# EAGLE design v0.0.1 (EAGLE 9.3.0)
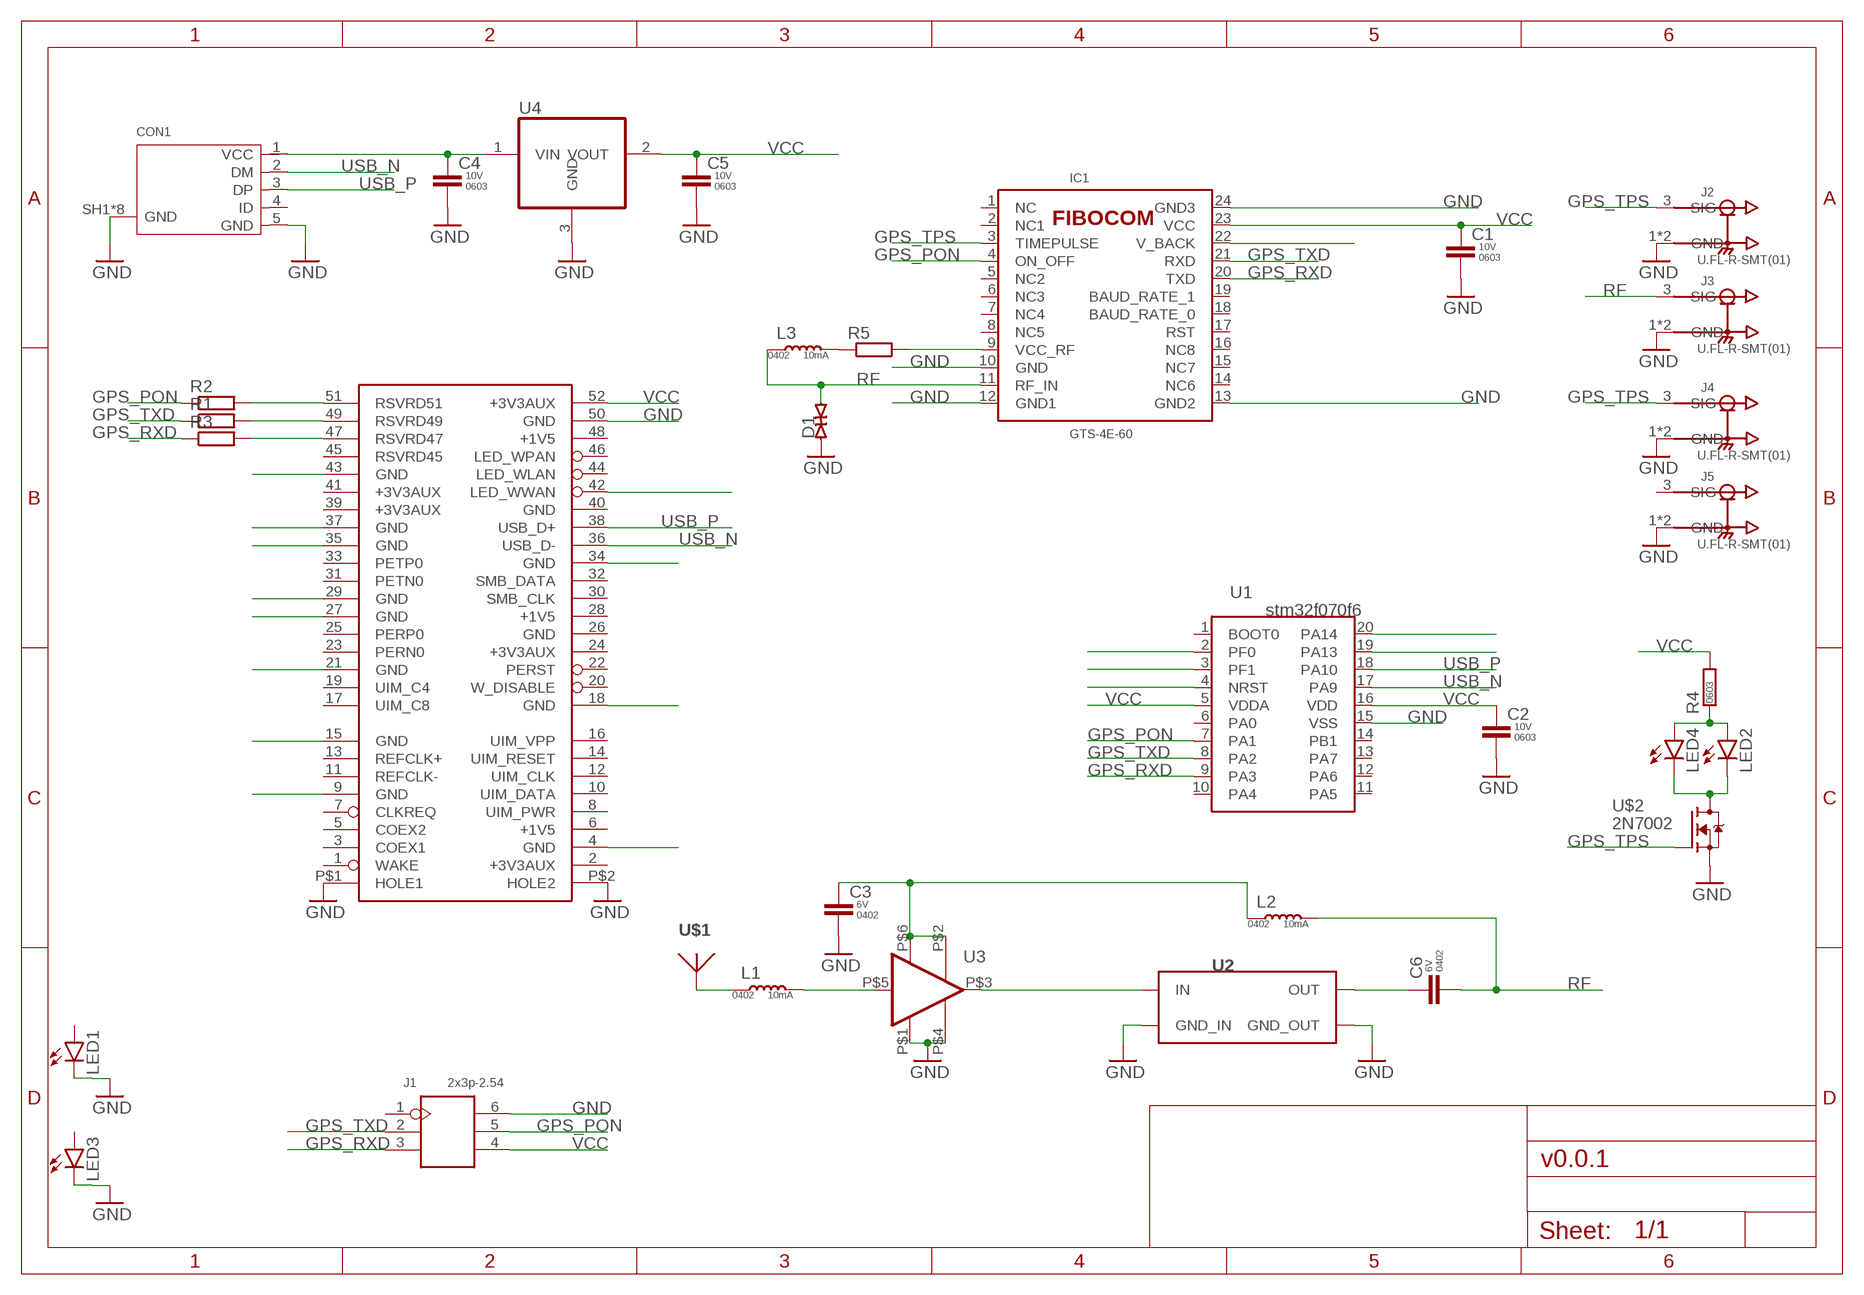
[diagram p0: schematic, sheet 1]

## Parts
C1  CAP-0603  [C0603]
C2  CAP-0603  [C0603]
C3  CAP-0402  [C0402K]
C4  CAP-0603  [C0603]
C5  CAP-0603  [C0603]
C6  CAP-0402  [C0402K]
CON1  10118194-0001LF  [10118194]
D1  ESD9B5.0ST5G  [SOD1006X40]
FORM1  MPCIE  [MPCIE]
IC1  GTS-4E-60  [_GTS_4E_60]
J1  2x3p-2.54  DIP-LONG-BLUE-FEMALE-HEADER(2X3P-2.54)  [H2X3-2.54]
J2  U.FL-R-SMT(01)  [HRS_U.FL-R-SMT(01)]
J3  U.FL-R-SMT(01)  [HRS_U.FL-R-SMT(01)]
J4  U.FL-R-SMT(01)  [HRS_U.FL-R-SMT(01)]
J5  U.FL-R-SMT(01)  [HRS_U.FL-R-SMT(01)]
L1  IND-0402  [L0402]
L2  IND-0402  [L0402]
L3  IND-0402  [L0402]
LED1  LEDCHIP-LED0805  [CHIP-LED0805]
LED2  LEDCHIP-LED0805  [CHIP-LED0805]
LED3  LEDCHIP-LED0805  [CHIP-LED0805]
LED4  LEDCHIP-LED0805  [CHIP-LED0805]
R1  R-EU_R0402  [R0402]
R2  R-EU_R0402  [R0402]
R3  R-EU_R0402  [R0402]
R4  RES-0603  [R0603]
R5  R-EU_R0402  [R0402]
U1  STM32F070F6  [SOP65P640X120-20]
U2  B3916B8813P810  [XSON5]
U3  BGU8019  [XSON6]
U4  AP7333-33SAG-7  [SOT95P240X110-3]
U$1  ANT1590-2540A  [2540A]
U$2  2N7002  [SOT95P240X110-3]

## Nets
GND: C1.2 C2.2 C3.2 C4.2 C5.2 CON1.5(GND) CON1.SH1(GND) CON1.SH2(GND) CON1.SH3(GND) CON1.SH4(GND) CON1.SH5(GND) CON1.SH6(GND) CON1.SH7(GND) CON1.SH8(GND) D1.1(A) FORM1.4(GND) FORM1.9(GND) FORM1.15(GND) FORM1.18(GND) FORM1.21(GND) FORM1.27(GND) FORM1.29(GND) FORM1.34(GND) FORM1.35(GND) FORM1.37(GND) FORM1.43(GND) FORM1.50(GND) FORM1.P$1(HOLE1) FORM1.P$2(HOLE2) IC1.10(GND) IC1.12(GND1) IC1.13(GND2) IC1.24(GND3) J1.6 J2.1(GND) J2.2(GND) J3.1(GND) J3.2(GND) J4.1(GND) J4.2(GND) J5.1(GND) J5.2(GND) LED1.C LED3.C U1.15(VSS) U2.2(GND_IN) U2.3(GND_OUT) U2.5(GND_IN) U3.P$1(GND) U3.P$4(GND_RF) U4.3(GND) U$2.2(S)
GPS_PON: IC1.4(ON_OFF) J1.5 R2.1 U1.7(PA1)
GPS_RXD: IC1.20(TXD) J1.3 R3.1 U1.9(PA3)
GPS_TPS: IC1.3(TIMEPULSE) J2.3(SIG) J4.3(SIG) U$2.1(G)
GPS_TXD: IC1.21(RXD) J1.2 R1.1 U1.8(PA2)
N$1: IC1.22(V_BACK)
N$2: FORM1.51(RSVRD51) R2.2
N$3: FORM1.49(RSVRD49) R1.2
N$4: FORM1.47(RSVRD47) R3.2
N$5: L1.1 U$1.P$1
N$6: L1.2 U3.P$5(RF_IN)
N$7: FORM1.42(LED_WWAN)
N$8: U1.2(PF0)
N$9: U1.3(PF1)
N$10: U2.1(IN) U3.P$3(RF_OUT)
N$11: C3.1 L2.1 U3.P$2(VCC) U3.P$6(ENABLE)
N$12: U1.4(NRST)
N$13: U1.19(PA13)
N$14: C6.1 U2.4(OUT)
N$15: U1.20(PA14)
N$16: LED2.C LED4.C U$2.3(D)
N$17: LED2.A LED4.A R4.1
N$18: C4.1 CON1.1(VCC) U4.1(VIN)
N$19: IC1.9(VCC_RF) R5.2
N$20: L3.2 R5.1
RF: C6.2 D1.2(C) IC1.11(RF_IN) J3.3(SIG) L2.2 L3.1
USB_N: CON1.2(DM) FORM1.36(USB_D-) U1.17(PA9)
USB_P: CON1.3(DP) FORM1.38(USB_D+) U1.18(PA10)
VCC: C1.1 C2.1 C5.1 FORM1.52(+3V3AUX) IC1.23(VCC) J1.4 R4.2 U1.5(VDDA) U1.16(VDD) U4.2(VOUT)
Unconnected: CON1.4(ID) FORM1.1(WAKE) FORM1.3(COEX1) FORM1.5(COEX2) FORM1.7(CLKREQ) FORM1.8(UIM_PWR) FORM1.10(UIM_DATA) FORM1.11(REFCLK-) FORM1.12(UIM_CLK) FORM1.13(REFCLK+) FORM1.14(UIM_RESET) FORM1.16(UIM_VPP) FORM1.17(UIM_C8) FORM1.19(UIM_C4) FORM1.20(W_DISABLE) FORM1.22(PERST) FORM1.23(PERN0) FORM1.25(PERP0) FORM1.30(SMB_CLK) FORM1.31(PETN0) FORM1.33(PETP0) FORM1.39(+3V3AUX) FORM1.40(GND) FORM1.41(+3V3AUX) FORM1.44(LED_WLAN) FORM1.45(RSVRD45) FORM1.46(LED_WPAN) FORM1.48(+1V5) IC1.1(NC) IC1.2(NC1) IC1.5(NC2) IC1.6(NC3) IC1.7(NC4) IC1.8(NC5) IC1.14(NC6) IC1.15(NC7) IC1.16(NC8) IC1.17(RST) IC1.18(BAUD_RATE_0) IC1.19(BAUD_RATE_1) J1.1 J5.3(SIG) LED1.A LED3.A U1.1(BOOT0) U1.6(PA0) U1.10(PA4) U1.11(PA5) U1.12(PA6) U1.13(PA7) U1.14(PB1)

## Power pins joined to a net without a drawn wire
+1V5: FORM1.6(+1V5) FORM1.28(+1V5)
+3V3AUX: FORM1.2(+3V3AUX) FORM1.24(+3V3AUX)
GND: FORM1.26(GND)
SMB_DATA: FORM1.32(SMB_DATA)

## Library data of the parts
C1 C2 C4 C5 = parts-passives:CAP-; PACKAGE: 0603; RATING: 10V
C3 C6 = parts-passives:CAP-; PACKAGE: 0402; RATING: 6V
CON1 = parts-amphenol:10118194-00
D1 = parts-onsemi:ESD9B
FORM1 = parts-pci:MPCIE
IC1 = parts-fibocom:GTS-4E-60: The GTS-4E is a new generation of GPS receiving module. FIBOCOM GTS 4E 60
J1 = Seeed-Connector:DIP-LONG-BLUE-FEMALE-HEADER(2X3P-2.54): 320030066
J2-J5 = parts-molex:U.FL-R-SMT(01): U.FL Series 6 Ghz 50 Ohm Ultra-small SMT Coaxial Cable Receptacle; AVAILABILITY: Unavailable; DESCRIPTION: U.FL Series 6 Ghz 50 Ohm Ultra-small SMT Coaxial Cable Receptacle; MF: Hirose; MP: U.FL-R-SMT_01_; PACKAGE: None; PRICE: None
L1-L3 = parts-passives:IND-; CURRENT: 10mA; PACKAGE: 0402
LED1-LED4 = led:LED: LED OSRAM: - CHIPLED LG R971, LG N971, LY N971, LG Q971, LY Q971, LO R971, LY R971 LH N974, LH R974 LS Q976, LO Q976, LY Q976 LO Q996 - Hyper CHIPLED LW Q18S LB Q993, LB Q99A, LB R99A - SideLED LS A670, LO A670, LY A670, LG A670, LP A670 LB A673, LV A673, LT A673, LW A673 LH A674 LY A675 LS A676, LA A676, LO A676, LY A676, LW A676 LS A679, LY A679, LG A679 - Hyper Micro SIDELED® LS Y876, LA Y876, LO Y876, LY Y876 LT Y87S - SmartLED LW L88C, LW L88S LB L89C, LB L89S, LG L890 LS L89K, LO L89K, LY L89K LS L896, LA L896, LO L896, LY L896 - TOPLED LS T670, LO T670, LY T670, LG T670, LP T670 LSG T670, LSP T670, LSY T670, LOP T670, LYG T670 LG T671, LOG T671, LSG T671 LB T673, LV T673, LT T673, LW T673 LH T674 LS T676, LA T676, LO T676, LY T676, LB T676, LH T676, LSB T676, LW T676 LB T67C, LV T67C, LT T67C, LS T67K, LO T67K, LY T67K, LW E67C LS E67B, LA E67B, LO E67B, LY E67B, LB E67C, LV E67C, LT E67C LW T67C LS T679, LY T679, LG T679 LS T770, LO T770, LY T770, LG T770, LP T770 LB T773, LV T773, LT T773, LW T773 LH T774 LS E675, LA E675, LY E675, LS T675 LS T776, LA T776, LO T776, LY T776, LB T776 LHGB T686 LT T68C, LB T68C - Hyper Mini TOPLED® LB M676 - Mini TOPLED Santana® LG M470 LS M47K, LO M47K, LY M47K Source: http://www.osram.convergy.de LUXEON: - LUMILED® LXK2-PW12-R00, LXK2-PW12-S00, LXK2-PW14-U00, LXK2-PW14-V00 LXK2-PM12-R00, LXK2-PM12-S00, LXK2-PM14-U00 LXK2-PE12-Q00, LXK2-PE12-R00, LXK2-PE12-S00, LXK2-PE14-T00, LXK2-PE14-U00 LXK2-PB12-K00, LXK2-PB12-L00, LXK2-PB12-M00, LXK2-PB14-N00, LXK2-PB14-P00, LXK2-PB14-Q00 LXK2-PR12-L00, LXK2-PR12-M00, LXK2-PR14-Q00, LXK2-PR14-R00 LXK2-PD12-Q00, LXK2-PD12-R00, LXK2-PD12-S00 LXK2-PH12-R00, LXK2-PH12-S00 LXK2-PL12-P00, LXK2-PL12-Q00, LXK2-PL12-R00 Source: www.luxeon.com KINGBRIGHT: KA-3528ASYC Source: www.kingbright.com
R1-R3 R5 = rcl:R-EU_: RESISTOR, European symbol; SPICEPREFIX: R
R4 = parts-passives:RES-; PACKAGE: 0603
U1 = parts-st:STM32F070F6
U2 = parts-rf360:B3916
U3 = parts-nxp:BGU8019
U4 = parts-diodes:AP7333-
U$1 = parts-srpassives:ANT1590-
U$2 = parts-onsemi:2N7002

## Board
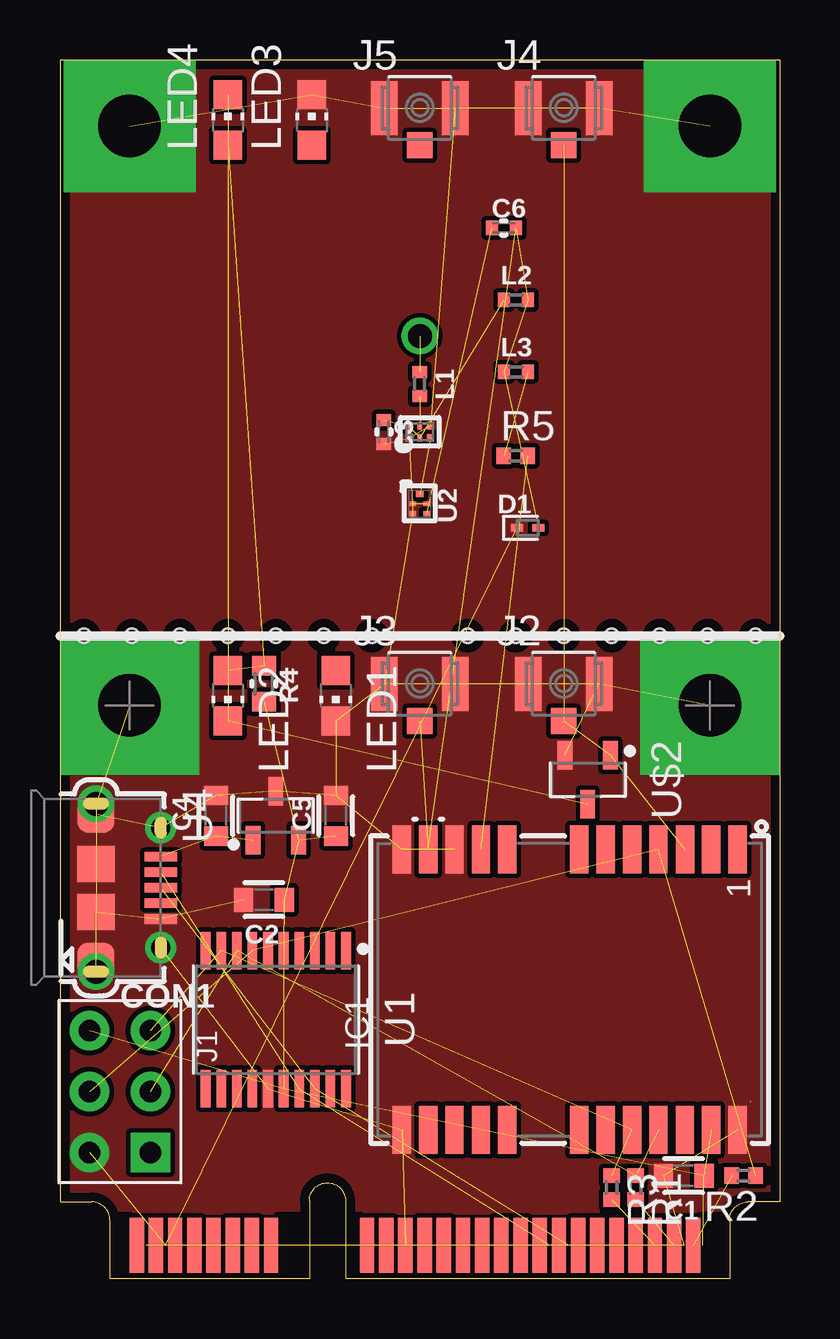
[diagram p1: board, top side]
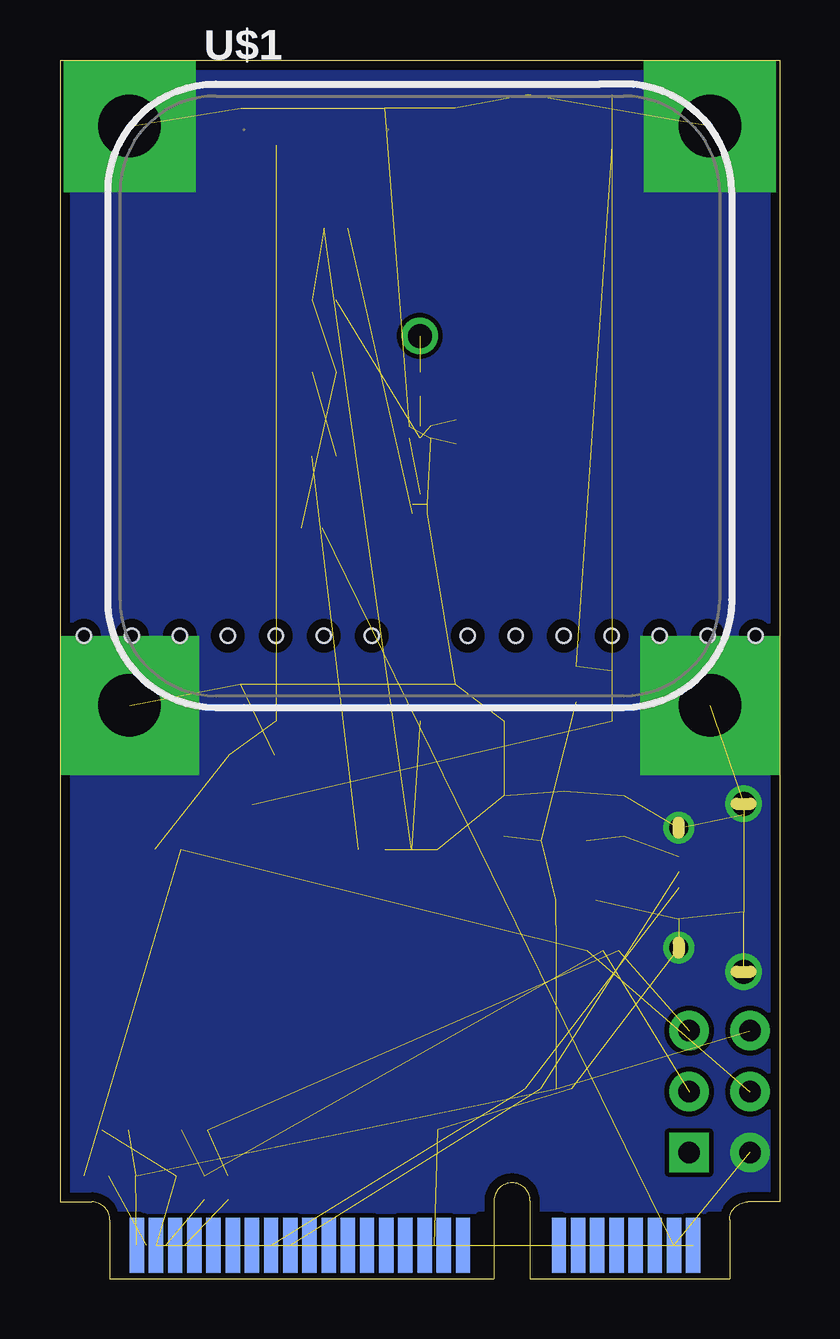
[diagram p2: board, bottom side, seen from below]

Size 30 x 50.8 mm. Coordinates in mm from the lower left corner, seen from the top.
Copper layers (1*16): Top 0.035mm / dielectric 0.9mm / Bottom 0.035mm
Design rules "default *": minimum track width 6mil, minimum drill 0.3mm, track to track 6mil, track to pad 6mil, pad to pad 6mil, via to via 6mil, smd to smd 6mil, copper to edge 0.4mm, drill to drill 6mil, minimum pad ring 10mil, minimum via ring 8mil, stop-mask expansion 4mil, vias tented up to drill 0mil, thermal gap 10mil
Holes 0.6 mm at 1,26.8 3,26.8 5,26.8 7,26.8 9,26.8 11,26.8 13,26.8 17,26.8 19,26.8 21,26.8 23,26.8 25,26.8 27,26.8 29,26.8

### Footprints (pad centres in the part's own frame; a part is rotated, then mirrored left to right if it is on the bottom)
C0603 = smd 0.8 x 1: 1 -0.85,0; 2 0.85,0
C0402K = smd 0.5 x 0.6: 1 -0.5,0; 2 0.5,0
10118194 = smd 0.4 x 1.35: 1 -1.3,2.7; 2 -0.65,2.7; 3 0,2.7; 4 0.65,2.7; 5 1.3,2.7 | drill 0.8: SH1 -2.5,2.7; SH2 2.5,2.7 | drill 1: SH3 -3.5,0; SH8 3.5,0 | smd 1.5 x 1.55: SH4 -3.05,0; SH5 -1,0; SH6 1,0; SH7 3.05,0
SOD1006X40 = smd 0.495 x 0.32: 1 -0.453,0; 2 0.453,0
MPCIE = smd 0.6 x 2.3: 1 -11.8,-49.4; 3 -11,-49.4; 5 -10.2,-49.4; 7 -9.4,-49.4; 9 -8.6,-49.4; 11 -7.8,-49.4; 13 -7,-49.4; 15 -6.2,-49.4; 17 -2.2,-49.4; 19 -1.4,-49.4; 21 -0.6,-49.4; 23 0.2,-49.4; 25 1,-49.4; 27 1.8,-49.4; 29 2.6,-49.4; 31 3.4,-49.4; 33 4.2,-49.4; 35 5,-49.4; 37 5.8,-49.4; 39 6.6,-49.4; 41 7.4,-49.4; 43 8.2,-49.4; 45 9,-49.4; 47 9.8,-49.4; 49 10.6,-49.4; 51 11.4,-49.4 | smd 0.6 x 2.3 bottom: 2 -11.4,-49.4; 4 -10.6,-49.4; 6 -9.8,-49.4; 8 -9,-49.4; 10 -8.2,-49.4; 12 -7.4,-49.4; 14 -6.6,-49.4; 16 -5.8,-49.4; 18 -1.8,-49.4; 20 -1,-49.4; 22 -0.2,-49.4; 24 0.6,-49.4; 26 1.4,-49.4; 28 2.2,-49.4; 30 3,-49.4; 32 3.8,-49.4; 34 4.6,-49.4; 36 5.4,-49.4; 38 6.2,-49.4; 40 7,-49.4; 42 7.8,-49.4; 44 8.6,-49.4; 46 9.4,-49.4; 48 10.2,-49.4; 50 11,-49.4; 52 11.8,-49.4 | drill 2.6 pad 5.5 square: P$1 12.1,-2.75; P$2 -12.1,-2.75
_GTS_4E_60 = smd 0.76 x 2: 1 -7,-5.85; 2 -5.9,-5.85; 3 -4.81,-5.85; 4 -3.7,-5.85; 5 -2.6,-5.85; 6 -1.5,-5.85; 7 -0.4,-5.85; 8 2.6,-5.85; 9 3.7,-5.85; 10 4.8,-5.85; 11 5.9,-5.85; 12 7,-5.85; 13 7,5.85; 14 5.9,5.85; 15 4.8,5.85; 16 3.7,5.85; 17 2.6,5.85; 18 -0.4,5.85; 19 -1.5,5.85; 20 -2.6,5.85; 21 -3.7,5.85; 22 -4.8,5.85; 23 -5.9,5.85; 24 -7,5.85
H2X3-2.54 = drill 0.889 pad 1.651 square: 1 -1.27,2.54 | drill 0.889 pad 1.651: 2 -1.27,0; 3 -1.27,-2.54; 4 1.27,-2.54; 5 1.27,0; 6 1.27,2.54
HRS_U.FL-R-SMT(01) = smd 1.1 x 2.25: 1 -1.475,0; 2 1.475,0 | smd 1.05 x 1.1: 3 0,-1.55
L0402 = smd 0.5 x 0.6: 1 -0.5,0; 2 0.5,0
CHIP-LED0805 = smd 1.2 x 1.2: A 0,-1.05; C 0,1.05
R0402 = smd 0.6 x 0.7: 1 -0.5,0; 2 0.5,0
R0603 = smd 0.8 x 1: 1 -0.75,0; 2 0.75,0
SOP65P640X120-20 = smd 1.559 x 0.407: 1 -2.878,2.925; 2 -2.878,2.275; 3 -2.878,1.625; 4 -2.878,0.975; 5 -2.878,0.325; 6 -2.878,-0.325; 7 -2.878,-0.975; 8 -2.878,-1.625; 9 -2.878,-2.275; 10 -2.878,-2.925; 11 2.878,-2.925; 12 2.878,-2.275; 13 2.878,-1.625; 14 2.878,-0.975; 15 2.878,-0.325; 16 2.878,0.325; 17 2.878,0.975; 18 2.878,1.625; 19 2.878,2.275; 20 2.878,2.925
XSON5 = smd 0.25 x 0.3: 1 -0.4,0 | smd 0.2 x 0.3: 2 0,-0.3; 3 0.4,-0.3; 4 0.4,0.3; 5 0,0.3
XSON6 = smd 0.3 x 0.3: P$1 0.25,-0.45; P$3 0.25,0.45; P$4 -0.25,0.45; P$6 -0.25,-0.45 | smd 0.3 x 0.2: P$2 0.25,0; P$5 -0.25,0
SOT95P240X110-3 = smd 1.18 x 0.609: 1 -1.024,0.95; 2 -1.024,-0.95; 3 1.024,0
2540A = drill 1: P$1 0,2.5

### Placement (x,y rotation side)
C1  26,4.3 180 top
C2  8.5,15.8 180 top
C3  13.5,35.3 270 top
C4  6.5,19.3 90 top
C5  11.5,19.3 90 top
C6  18.5,43.8 0 top
CON1  1.5,16.3 270 top
D1  19.5,31.3 0 top
FORM1  15,50.8 0 top
IC1  21.25,12.05 180 top
J1  2.5,7.8 180 top
J2  21,24.8 0 top
J3  15,24.8 0 top
J4  21,48.8 0 top
J5  15,48.8 0 top
L1  15,37.3 270 top
L2  19,40.8 0 top
L3  19,37.8 0 top
LED1  11.5,24.3 180 top
LED2  7,24.3 180 top
LED3  10.5,48.3 0 top
LED4  7,48.3 0 top
R1  24,3.8 270 top
R2  28.5,4.3 180 top
R3  23,3.8 270 top
R4  8.5,24.8 270 top
R5  19,34.3 0 top
U1  9,10.8 270 top
U2  15,32.3 270 top
U3  15,35.3 270 top
U4  9,19.3 90 top
U$1  15,36.8 0 bottom
U$2  22,20.8 270 top

### Tracks (layer width: path | path; a pad name or v marks a point on that pad's centre or on a via)
+1V5  (1 unrouted)
+3V3AUX  (1 unrouted)
GND  (via drill 2.6 pad 5.8)  (54 unrouted)
  other vias: 2.9,23.9 27.1,23.9
  pour Top (isolate 0.2, rank 6, no thermals): 32,2.8 32,52.8 -2,52.8 -2,2.8
  pour Bottom (isolate 0.2, rank 6, no thermals): -1,51.8 -1,2.8 31,2.8 31,51.8
GPS_PON  (3 unrouted)
GPS_RXD  (3 unrouted)
GPS_TPS  (3 unrouted)
GPS_TXD  (3 unrouted)
N$2  (1 unrouted)
N$3  (1 unrouted)
N$4  (1 unrouted)
N$5  (1 unrouted)
N$6  (1 unrouted)
N$10  (1 unrouted)
N$11  (3 unrouted)
N$14  (1 unrouted)
N$16  (2 unrouted)
N$17  (2 unrouted)
N$18  (2 unrouted)
N$19  (1 unrouted)
N$20  (1 unrouted)
RF  (5 unrouted)
USB_N  (2 unrouted)
USB_P  (2 unrouted)
VCC  (9 unrouted)